# Altium schematic sheet SWD_Cat_Programmer.SchDoc
size 297 x 210 mm
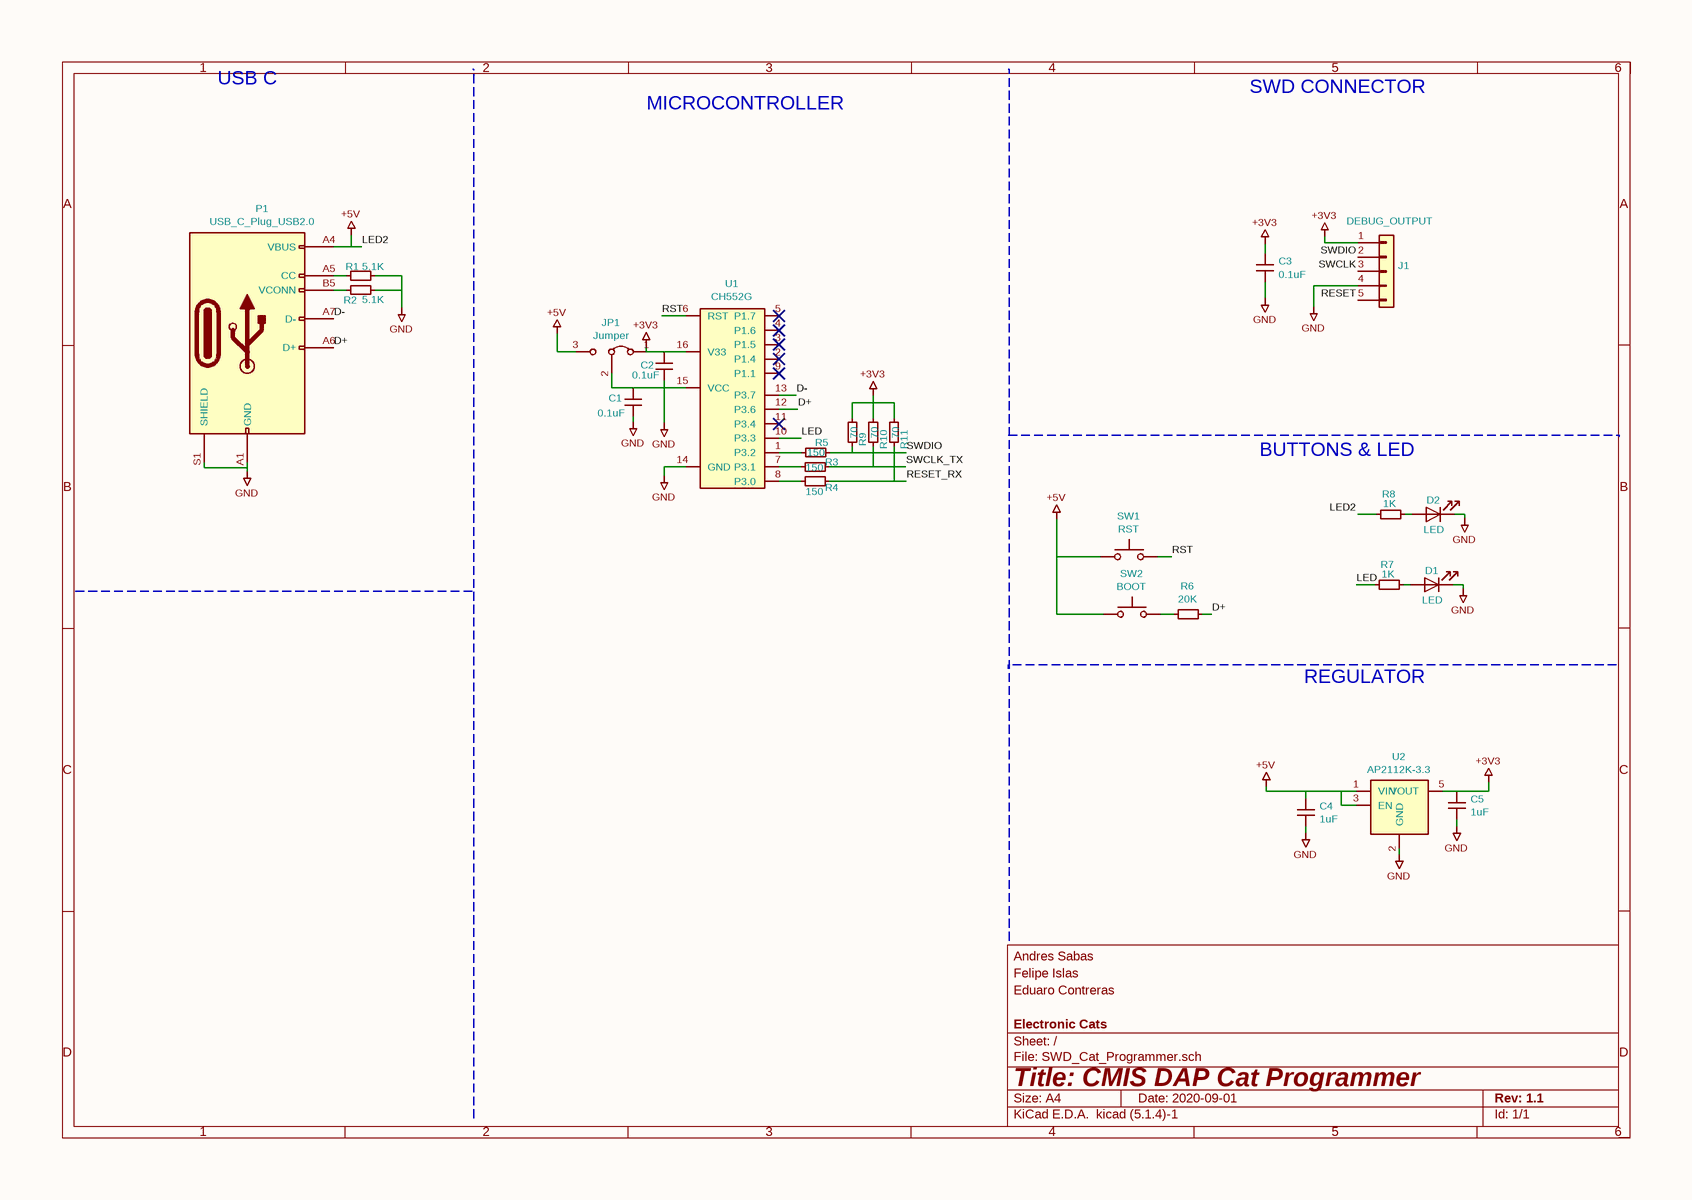
[diagram p0: SWD_Cat_Programmer.SchDoc]

## Parts
C1  0.1uF  [C_0805_2012Metric_Pad1.15x1.40mm_HandSolder]
C2  0.1uF  [C_0805_2012Metric_Pad1.15x1.40mm_HandSolder]
C3  0.1uF  [C_0805_2012Metric_Pad1.15x1.40mm_HandSolder]
C4  1uF  [C_0805_2012Metric_Pad1.15x1.40mm_HandSolder]
C5  1uF  [C_0805_2012Metric_Pad1.15x1.40mm_HandSolder]
D1  LED  [LED_0805_2012Metric]
D2  LED  [LED_0805_2012Metric]
J1  DEBUG_OUTPUT  [PinHeader_1x05_P2.54mm_Horizontal]
JP1  Jumper  [SolderJumper-3_P1.3mm_Bridged12_RoundedPad1.0x1.5mm]
P1  USB_C_Plug_USB2.0  [C393939]
R1  5.1K  [R_0805_2012Metric_Pad1.15x1.40mm_HandSolder]
R2  5.1K  [R_0805_2012Metric_Pad1.15x1.40mm_HandSolder]
R3  150  [R_0805_2012Metric_Pad1.15x1.40mm_HandSolder]
R4  150  [R_0805_2012Metric_Pad1.15x1.40mm_HandSolder]
R5  150  [R_0805_2012Metric_Pad1.15x1.40mm_HandSolder]
R6  20K  [R_0805_2012Metric_Pad1.15x1.40mm_HandSolder]
R7  1K  [R_0805_2012Metric_Pad1.15x1.40mm_HandSolder]
R8  1K  [R_0805_2012Metric_Pad1.15x1.40mm_HandSolder]
R9  70  [R_0603_1608Metric_Pad1.05x0.95mm_HandSolder]
R10  70  [R_0603_1608Metric_Pad1.05x0.95mm_HandSolder]
R11  70  [R_0603_1608Metric_Pad1.05x0.95mm_HandSolder]
SW1  RST  [TS1088R02026]
SW2  BOOT  [TS1088R02026]
U1  CH552G  [SOP-16_4.55x10.3mm_P1.27mm]
U2  AP2112K-3.3  [SOT-23-5]

## Nets
+3V3: C2.1 C3.1 C5.1 J1.1(Pin_1) JP1.1(A) R9.2 R10.2 R11.2 U1.16(V33) U2.5(VOUT)
GND: C1.2 C2.2 C3.2 C4.2 C5.2 D1.1(K) D2.1(K) J1.4(Pin_4) P1.A1(GND) P1.S1(SHIELD) R1.1 R2.1 U1.14(GND) U2.2(GND)
LED2: C4.1 JP1.3(B) P1.A4(VBUS) R8.2 SW1.1 SW2.1 U2.1(VIN) U2.3(EN)  [also labelled +5V]
D+: P1.A6(D+) R6.1 U1.12(P3.6)
D-: P1.A7(D-) U1.13(P3.7)
LED: R7.2 U1.10(P3.3)
RESET: J1.5(Pin_5)
RESET_RX: R4.1 R11.1
RST: SW1.2 U1.6(RST)
SWCLK: J1.3(Pin_3)
SWCLK_TX: R3.1 R10.1
SWDIO: J1.2(Pin_2) R5.1 R9.1
NetC1_1: C1.1 JP1.2(C) U1.15(VCC)
NetD1_2: D1.2(A) R7.1
NetD2_2: D2.2(A) R8.1
NetP1_A5: P1.A5(CC) R1.2
NetP1_B5: P1.B5(VCONN) R2.2
NetR3_2: R3.2 U1.7(P3.1)
NetR4_2: R4.2 U1.8(P3.0)
NetR5_2: R5.2 U1.1(P3.2)
NetR6_2: R6.2 SW2.2

Not connected (* = marked no-connect by the designer): P1 A9(VBUS) A12(GND) B1(GND) B4(VBUS) B9(VBUS) B12(GND); U1 2(P1.4)* 3(P1.5)* 4(P1.6)* 5(P1.7)* 9(P1.1)* 11(P3.4)*; U2 4(NC)

## Notes on the sheet
- USB C
- MICROCONTROLLER
- SWD CONNECTOR
- BUTTONS & LED
- REGULATOR
- 1
- 2
- 3
- 4
- 5
- 6
- A
- B
- C
- Eduaro Contreras
- Felipe Islas
- Andres Sabas
- D
- Title: CMIS DAP Cat Programmer
- File: SWD_Cat_Programmer.sch
- Sheet: /
- Electronic Cats
- KiCad E.D.A.  kicad (5.1.4)-1
- Size: A4
- Date: 2020-09-01
- Rev: 1.1
- Id: 1/1

## Library data of the parts
C1-C3 = C_Small: manf#: C49678; Value: 0.1uF; Footprint: Capacitor_SMD:C_0805_2012Metric_Pad1.15x1.40mm_HandSolder
C4 C5 = C_Small: manf#: C28323; Value: 1uF; Footprint: Capacitor_SMD:C_0805_2012Metric_Pad1.15x1.40mm_HandSolder
D1 D2 = LED: manf#: C131244; Value: LED; Footprint: LED_SMD:LED_0805_2012Metric
J1 = Conn_01x05: manf#: -; Value: DEBUG_OUTPUT; Footprint: Connector_PinHeader_2.54mm:PinHeader_1x05_P2.54mm_Horizontal
JP1 = Jumper_3_Bridged12: Value: Jumper; Footprint: Jumper:SolderJumper-3_P1.3mm_Bridged12_RoundedPad1.0x1.5mm
R1 R2 = R_Small: manf#: C105874; Value: 5.1K; Footprint: Resistor_SMD:R_0805_2012Metric_Pad1.15x1.40mm_HandSolder
R3-R5 = R_Small: manf#: C103997; Value: 150; Footprint: Resistor_SMD:R_0805_2012Metric_Pad1.15x1.40mm_HandSolder
R6 = R_Small: manf#: C702832; Value: 20K; Footprint: Resistor_SMD:R_0805_2012Metric_Pad1.15x1.40mm_HandSolder
R7 R8 = R_Small: manf#: C25623; Value: 1K; Footprint: Resistor_SMD:R_0805_2012Metric_Pad1.15x1.40mm_HandSolder
R9-R11 = R_Small: manf#: C429431; Value: 70; Footprint: Resistor_SMD:R_0603_1608Metric_Pad1.05x0.95mm_HandSolder
SW1 SW2 = SW_Push: manf#: C455281; Footprint: KiCad:TS1088R02026
  SW1: Value: RST
  SW2: Value: BOOT
U1 = CH552G-Electronic_Cats-SWD_Cat_Programmer-rescue-SWD_Cat_Programmer-rescue-SWD_Cat_Programmer-rescue: manf#: C111292; Value: CH552G; Footprint: Package_SO:SOP-16_4.55x10.3mm_P1.27mm
U2 = AP2112K-3.3: manf#: 621-AP2112K-3.3TRG1; Value: AP2112K-3.3; Footprint: Package_TO_SOT_SMD:SOT-23-5
P1 = USB_C_Plug_USB2.0: manf#: C393939; Value: USB_C_Plug_USB2.0; Footprint: Connectors:C393939